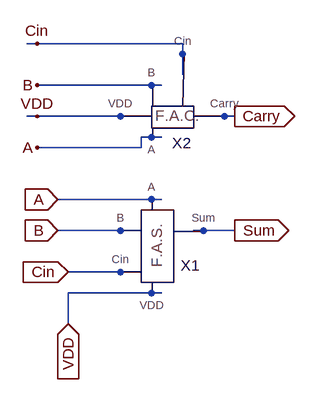
[diagram p0: schematic Full_Adder.asc]
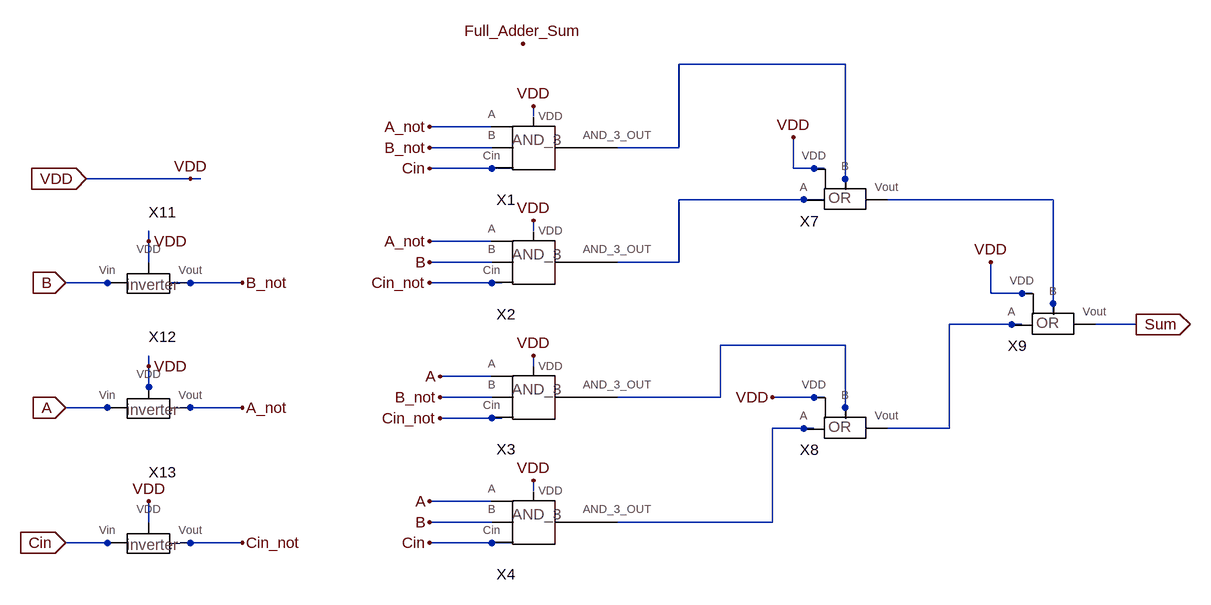
[diagram p1: sub-circuit fuller_adder_sum.asc]
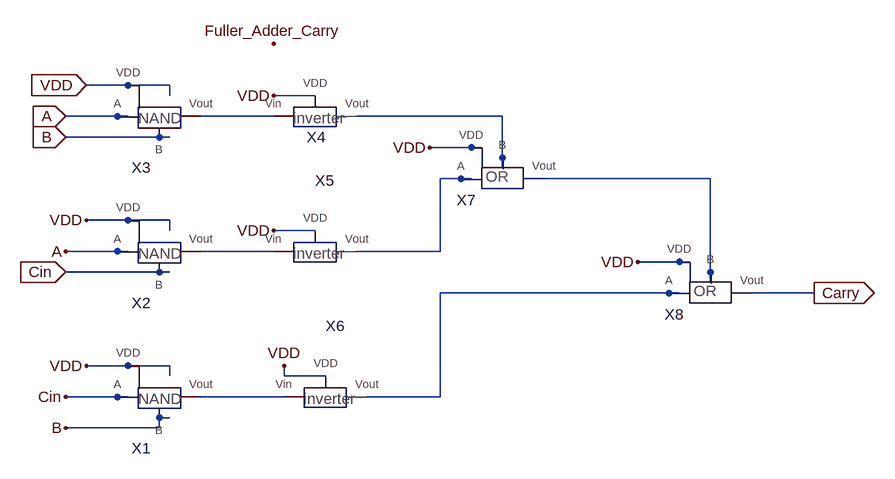
[diagram p2: sub-circuit fuller_adder_carry.asc]
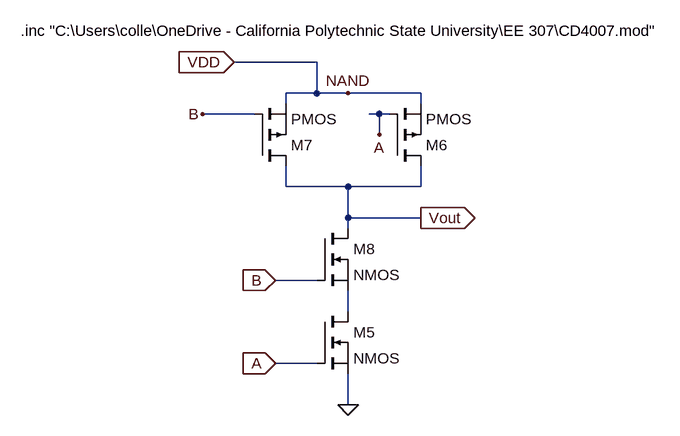
[diagram p3: sub-circuit nand_gate.asc]
Full_Adder.asc, the LTspice schematic file:
Version 4
SHEET 1 880 680
WIRE 16 -80 0 -80
WIRE 240 -80 16 -80
WIRE 240 -64 240 -80
WIRE 240 -32 240 -64
WIRE 192 -16 16 -16
WIRE 208 -16 192 -16
WIRE 16 32 0 32
WIRE 144 32 16 32
WIRE 160 32 144 32
WIRE 304 32 288 32
WIRE 320 32 304 32
WIRE 192 64 176 64
WIRE 208 64 192 64
WIRE 176 80 176 64
WIRE 176 80 16 80
WIRE 192 160 48 160
WIRE 208 160 192 160
WIRE 144 208 48 208
WIRE 160 208 144 208
WIRE 272 208 256 208
WIRE 320 208 272 208
WIRE 144 272 64 272
WIRE 160 272 144 272
WIRE 192 304 64 304
WIRE 208 304 192 304
WIRE 64 352 64 304
FLAG 64 352 VDD
IOPIN 64 352 In
FLAG 48 160 A
IOPIN 48 160 In
FLAG 48 208 B
IOPIN 48 208 In
FLAG 64 272 Cin
IOPIN 64 272 In
FLAG 320 208 Sum
IOPIN 320 208 Out
FLAG 320 32 Carry
IOPIN 320 32 Out
FLAG 16 80 A
FLAG 16 32 VDD
FLAG 16 -16 B
FLAG 16 -80 Cin
SYMBOL Fuller_Adder_Sum 256 256 R0
SYMATTR InstName X1
SYMBOL Fuller_Adder_Carry 256 48 R0
SYMATTR InstName X2

fuller_adder_sum.asc, the sub-circuit schematic file:
Version 4
SHEET 1 1184 936
WIRE 624 128 368 128
WIRE 144 208 144 192
WIRE 80 224 -16 224
WIRE 80 256 -16 256
WIRE 368 256 368 128
WIRE 368 256 272 256
WIRE 80 288 -16 288
WIRE 112 288 80 288
WIRE 544 288 544 240
WIRE 576 288 544 288
WIRE 592 288 576 288
WIRE -384 304 -544 304
WIRE -368 304 -384 304
WIRE 624 304 624 128
WIRE 624 320 624 304
WIRE 560 336 368 336
WIRE 592 336 560 336
WIRE 944 336 688 336
WIRE 144 384 144 368
WIRE -448 400 -448 384
WIRE 80 400 -16 400
WIRE -448 432 -448 400
WIRE 80 432 -16 432
WIRE 368 432 368 336
WIRE 368 432 272 432
WIRE -512 464 -576 464
WIRE -480 464 -512 464
WIRE -384 464 -416 464
WIRE -304 464 -384 464
WIRE 80 464 -16 464
WIRE 96 464 80 464
WIRE 848 480 848 432
WIRE 896 480 848 480
WIRE 912 480 896 480
WIRE 944 496 944 336
WIRE 944 512 944 496
WIRE 880 528 784 528
WIRE 896 528 880 528
WIRE 1072 528 1008 528
WIRE 624 560 432 560
WIRE -448 592 -448 576
WIRE 144 592 144 576
WIRE 80 608 0 608
WIRE -448 624 -448 592
WIRE -448 640 -448 624
WIRE 80 640 0 640
WIRE 432 640 432 560
WIRE 432 640 272 640
WIRE 576 640 512 640
WIRE 592 640 576 640
WIRE -512 656 -576 656
WIRE -480 656 -512 656
WIRE -384 656 -400 656
WIRE -304 656 -384 656
WIRE 624 656 624 560
WIRE 80 672 0 672
WIRE 96 672 80 672
WIRE 624 672 624 656
WIRE 560 688 512 688
WIRE 576 688 560 688
WIRE 784 688 784 528
WIRE 784 688 688 688
WIRE 144 784 144 768
WIRE 80 800 -16 800
WIRE -448 832 -448 800
WIRE 80 832 -16 832
WIRE 512 832 512 688
WIRE 512 832 272 832
WIRE -512 864 -576 864
WIRE -496 864 -512 864
WIRE -384 864 -400 864
WIRE -304 864 -384 864
WIRE 80 864 -16 864
WIRE 112 864 80 864
FLAG -576 464 B
IOPIN -576 464 In
FLAG -304 464 B_not
FLAG -576 656 A
IOPIN -576 656 In
FLAG -304 656 A_not
FLAG -16 224 A_not
FLAG -16 400 A_not
FLAG -16 256 B_not
FLAG 0 640 B_not
FLAG -16 800 A
FLAG 0 608 A
FLAG -16 288 Cin
FLAG -16 864 Cin
FLAG -16 432 B
FLAG -16 832 B
FLAG -16 464 Cin_not
FLAG 0 672 Cin_not
FLAG -576 864 Cin
IOPIN -576 864 In
FLAG -304 864 Cin_not
FLAG -544 304 VDD
IOPIN -544 304 In
FLAG -384 304 VDD
FLAG 512 640 VDD
FLAG 144 576 VDD
FLAG 144 368 VDD
FLAG 144 192 VDD
FLAG 144 768 VDD
FLAG 544 240 VDD
FLAG 848 432 VDD
FLAG 1072 528 Sum
IOPIN 1072 528 Out
FLAG 128 96 Full_Adder_Sum
FLAG -448 400 VDD
FLAG -448 592 VDD
FLAG -448 800 VDD
SYMBOL AND_3 176 256 R0
SYMATTR InstName X1
SYMBOL AND_3 176 432 R0
SYMATTR InstName X2
SYMBOL AND_3 176 640 R0
SYMATTR InstName X3
SYMBOL AND_3 176 832 R0
SYMATTR InstName X4
SYMBOL OR_gate 656 336 R0
SYMATTR InstName X7
SYMBOL OR_gate 656 688 R0
SYMATTR InstName X8
SYMBOL OR_gate 976 528 R0
SYMATTR InstName X9
SYMBOL Inverter -416 480 R0
SYMATTR InstName X11
SYMBOL Inverter -416 672 R0
SYMATTR InstName X12
SYMBOL Inverter -416 880 R0
SYMATTR InstName X13

fuller_adder_carry.asc, the sub-circuit schematic file:
Version 4
SHEET 1 1208 680
WIRE 96 -192 -32 -192
WIRE 96 -176 96 -192
WIRE 320 -176 256 -176
WIRE 32 -144 -64 -144
WIRE 160 -144 144 -144
WIRE 256 -144 160 -144
WIRE 608 -144 384 -144
WIRE 96 -112 -64 -112
WIRE 560 -96 496 -96
WIRE 576 -96 560 -96
WIRE 608 -80 608 -144
WIRE 608 -64 608 -80
WIRE 544 -48 512 -48
WIRE 560 -48 544 -48
WIRE 928 -48 672 -48
WIRE 96 16 -32 16
WIRE 96 32 96 16
WIRE 320 32 256 32
WIRE 32 64 -64 64
WIRE 160 64 144 64
WIRE 256 64 160 64
WIRE 512 64 512 -48
WIRE 512 64 384 64
WIRE 880 80 816 80
WIRE 896 80 880 80
WIRE 96 96 -64 96
WIRE 928 96 928 -48
WIRE 928 112 928 96
WIRE 864 128 512 128
WIRE 880 128 864 128
WIRE 1088 128 992 128
WIRE 96 240 -32 240
WIRE 96 256 96 240
WIRE 272 256 272 240
WIRE 336 256 272 256
WIRE 32 288 -64 288
WIRE 160 288 144 288
WIRE 272 288 160 288
WIRE 512 288 512 128
WIRE 512 288 400 288
WIRE 96 320 80 320
WIRE 80 336 80 320
WIRE 80 336 -64 336
FLAG 1088 128 Carry
IOPIN 1088 128 Out
FLAG -64 -144 A
IOPIN -64 -144 In
FLAG -64 64 A
FLAG -64 -112 B
IOPIN -64 -112 In
FLAG -64 336 B
FLAG -64 288 Cin
FLAG -64 96 Cin
IOPIN -64 96 In
FLAG -32 240 VDD
FLAG 272 240 VDD
FLAG 256 32 VDD
FLAG 256 -176 VDD
FLAG -32 16 VDD
FLAG 496 -96 VDD
FLAG 816 80 VDD
FLAG -32 -192 VDD
IOPIN -32 -192 In
FLAG 256 -256 Fuller_Adder_Carry
SYMBOL Nand_gate 128 304 R0
SYMATTR InstName X1
SYMBOL Nand_gate 128 80 R0
SYMATTR InstName X2
SYMBOL Nand_gate 128 -128 R0
SYMATTR InstName X3
SYMBOL Inverter 352 -128 R0
WINDOW 0 -45 16 Left 2
SYMATTR InstName X4
SYMBOL Inverter 352 80 R0
SYMATTR InstName X5
SYMBOL Inverter 368 304 R0
SYMATTR InstName X6
SYMBOL OR_gate 640 -48 R0
SYMATTR InstName X7
SYMBOL OR_gate 960 128 R0
SYMATTR InstName X8

nand_gate.asc, the sub-circuit schematic file:
Version 4
SHEET 1 880 680
WIRE -224 -192 -352 -192
WIRE -224 -144 -224 -192
WIRE -224 -144 -272 -144
WIRE -176 -144 -224 -144
WIRE -64 -144 -176 -144
WIRE -272 -128 -272 -144
WIRE -64 -128 -64 -144
WIRE -320 -112 -400 -112
WIRE -128 -112 -144 -112
WIRE -112 -112 -128 -112
WIRE -128 -80 -128 -112
WIRE -272 0 -272 -32
WIRE -176 0 -272 0
WIRE -64 0 -64 -32
WIRE -64 0 -176 0
WIRE -176 48 -176 0
WIRE -64 48 -176 48
WIRE -176 64 -176 48
WIRE -224 144 -288 144
WIRE -176 192 -176 160
WIRE -224 272 -288 272
WIRE -176 336 -176 288
FLAG -176 -144 NAND
FLAG -176 336 0
FLAG -288 272 A
IOPIN -288 272 In
FLAG -128 -80 A
FLAG -400 -112 B
FLAG -288 144 B
IOPIN -288 144 In
FLAG -64 48 Vout
IOPIN -64 48 Out
FLAG -352 -192 VDD
IOPIN -352 -192 In
SYMBOL nmos -224 192 R0
SYMATTR InstName M5
SYMBOL pmos -112 -32 M180
SYMATTR InstName M6
SYMBOL pmos -320 -32 M180
SYMATTR InstName M7
SYMBOL nmos -224 64 R0
SYMATTR InstName M8
TEXT -680 -240 Left 2 !.inc "C:\\Users\\colle\\OneDrive - California Polytechnic State University\\EE 307\\CD4007.mod"

The netlist it stands for:
* Full_Adder.asc
XX1 VDD A B Cin Sum fuller_adder_sum
XX2 Carry VDD B A Cin fuller_adder_carry

* block symbol definitions
.subckt fuller_adder_sum VDD A B Cin Sum
XX1 A_not B_not Cin VDD N001 AND_3  ; pins A B Cin VDD AND_3_OUT
XX2 A_not B Cin_not VDD N002 AND_3  ; pins A B Cin VDD AND_3_OUT
XX3 A B_not Cin_not VDD N005 AND_3  ; pins A B Cin VDD AND_3_OUT
XX4 A B Cin VDD N006 AND_3  ; pins A B Cin VDD AND_3_OUT
XX7 N002 N001 N003 VDD OR_gate  ; pins A B Vout VDD
XX8 N006 N005 N004 VDD OR_gate  ; pins A B Vout VDD
XX9 N004 N003 Sum VDD OR_gate  ; pins A B Vout VDD
XX11 B VDD B_not Inverter  ; pins Vin VDD Vout
XX12 A VDD A_not Inverter  ; pins Vin VDD Vout
XX13 Cin VDD Cin_not Inverter  ; pins Vin VDD Vout
.ends fuller_adder_sum

.subckt fuller_adder_carry Carry VDD B A Cin
XX1 Cin B N007 VDD nand_gate
XX2 A Cin N005 VDD nand_gate
XX3 A B N001 VDD nand_gate
XX4 N001 VDD N002 Inverter  ; pins Vin VDD Vout
XX5 N005 VDD N003 Inverter  ; pins Vin VDD Vout
XX6 N007 VDD N006 Inverter  ; pins Vin VDD Vout
XX7 N003 N002 N004 VDD OR_gate  ; pins A B Vout VDD
XX8 N006 N004 Carry VDD OR_gate  ; pins A B Vout VDD
.ends fuller_adder_carry

.subckt nand_gate A B Vout VDD
M5 N001 A 0 0 NMOS
M6 Vout A VDD VDD PMOS
M7 Vout B VDD VDD PMOS
M8 Vout B N001 N001 NMOS
.inc "C:\Users\colle\OneDrive - California Polytechnic State University\EE 307\CD4007.mod"
.ends nand_gate

.model NMOS NMOS
.model PMOS PMOS
.lib standard.mos
.backanno
.end